# EAGLE design registers-edge (EAGLE 5.11)

## Sheet 1 of 3
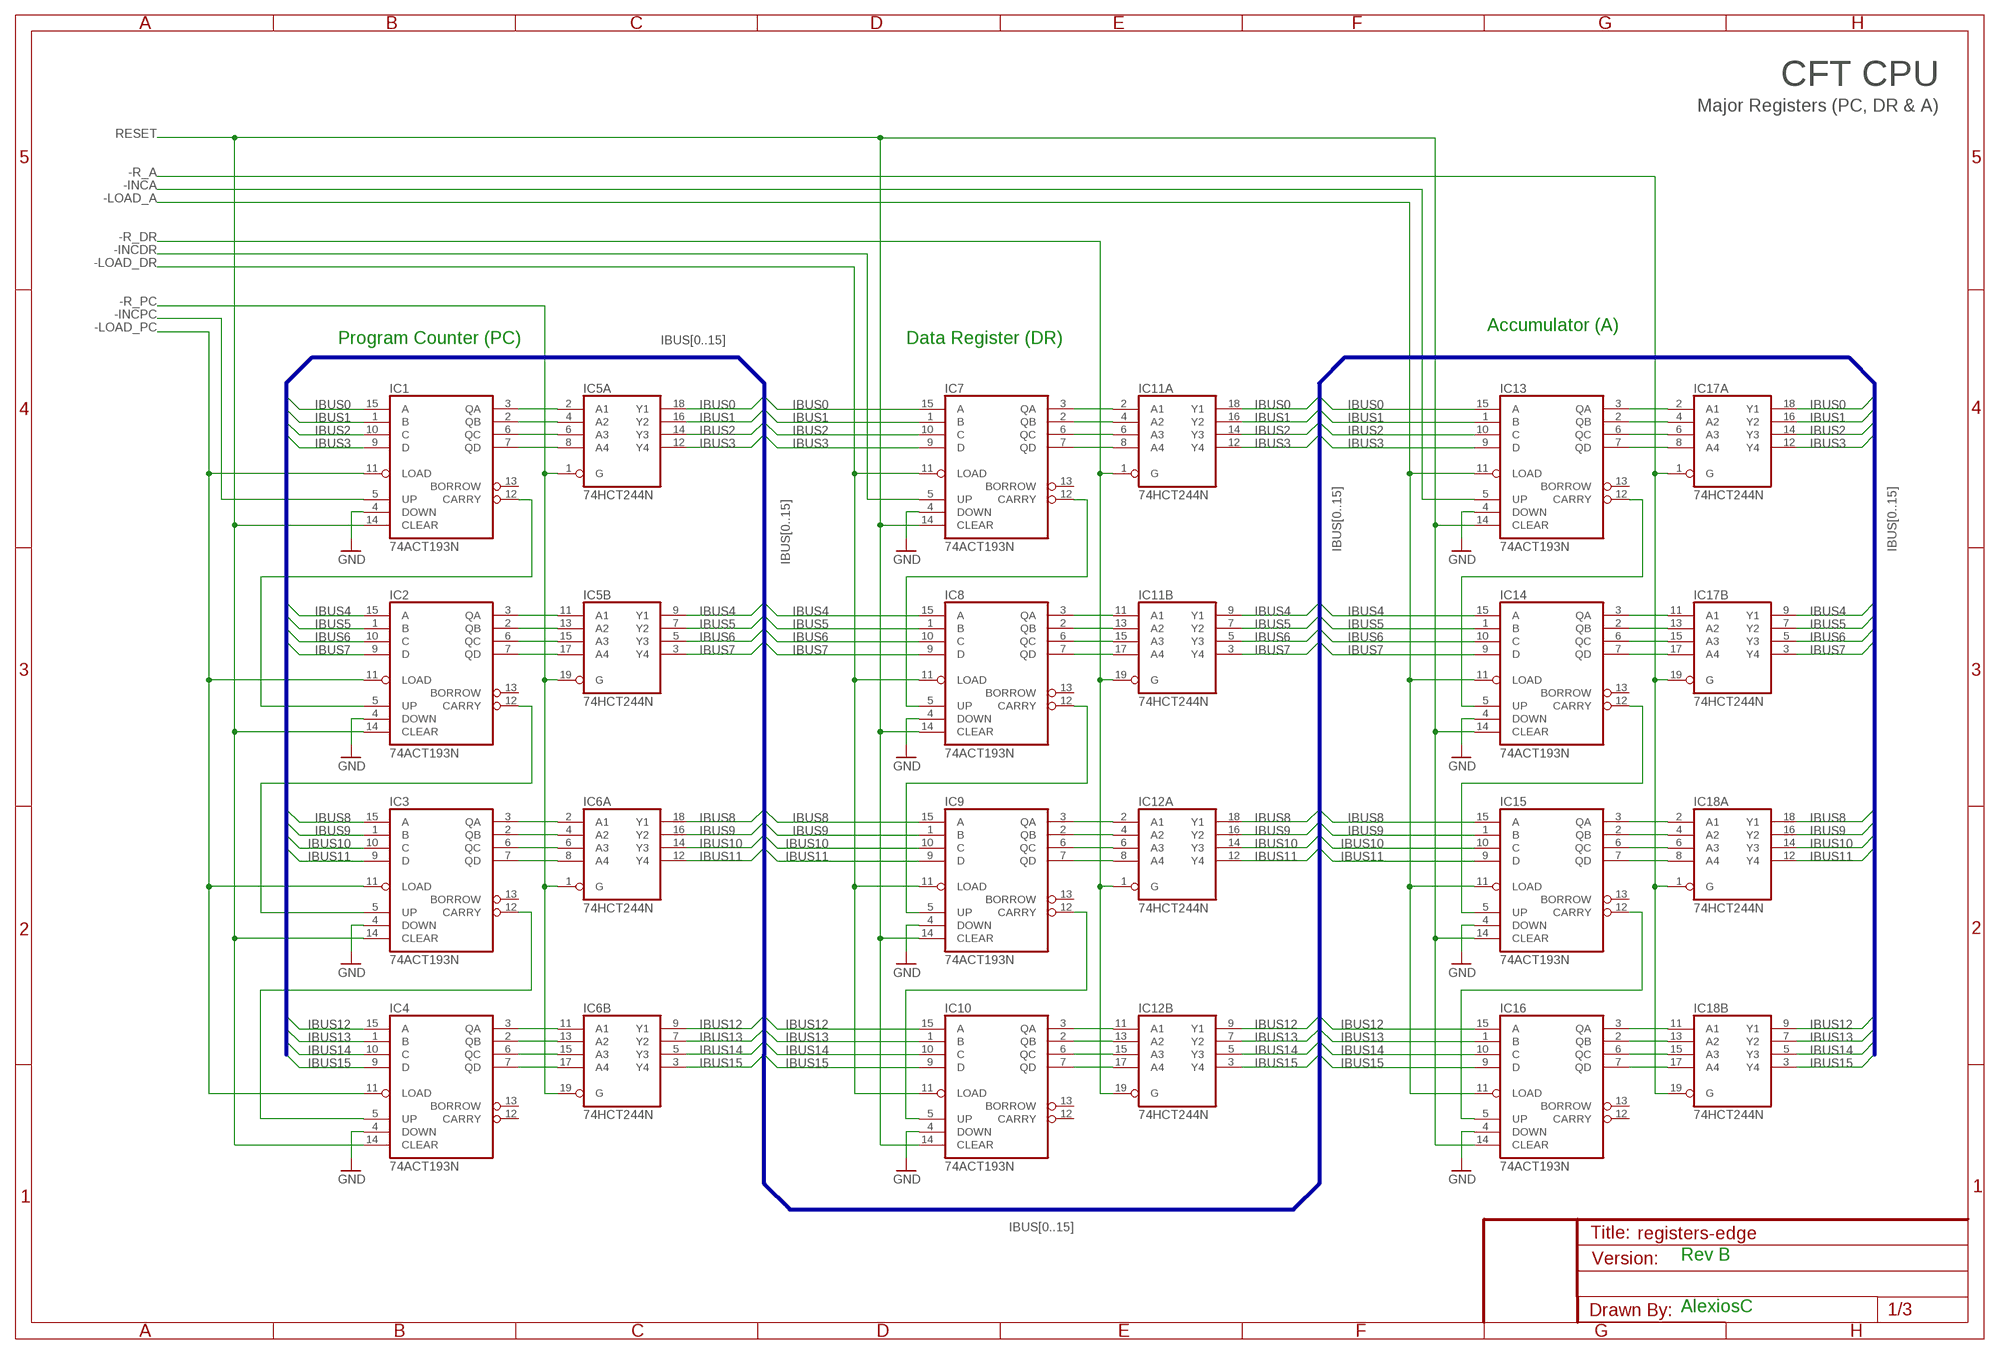
[diagram p0: schematic, sheet 1]

### Parts
IC1  74ACT193N  [DIL16]
IC2  74ACT193N  [DIL16]
IC3  74ACT193N  [DIL16]
IC4  74ACT193N  [DIL16]
IC5  74HCT244N  [DIL20]
IC6  74HCT244N  [DIL20]
IC7  74ACT193N  [DIL16]
IC8  74ACT193N  [DIL16]
IC9  74ACT193N  [DIL16]
IC10  74ACT193N  [DIL16]
IC11  74HCT244N  [DIL20]
IC12  74HCT244N  [DIL20]
IC13  74ACT193N  [DIL16]
IC14  74ACT193N  [DIL16]
IC15  74ACT193N  [DIL16]
IC16  74ACT193N  [DIL16]
IC17  74HCT244N  [DIL20]
IC18  74HCT244N  [DIL20]

### Nets
-INCA: IC13.5(UP) ; also sheet 3
-INCDR: IC7.5(UP) ; also sheet 3
-INCPC: IC1.5(UP) ; also sheet 3
-LOAD_A: IC13.11(LOAD) IC14.11(LOAD) IC15.11(LOAD) IC16.11(LOAD) ; also sheet 2
-LOAD_DR: IC7.11(LOAD) IC8.11(LOAD) IC9.11(LOAD) IC10.11(LOAD) ; also sheet 2
-LOAD_PC: IC1.11(LOAD) IC2.11(LOAD) IC3.11(LOAD) IC4.11(LOAD) ; also sheet 2
-R_A: IC17.1(A:G) IC17.19(B:G) IC18.1(A:G) IC18.19(B:G) ; also sheet 3
-R_DR: IC11.1(A:G) IC11.19(B:G) IC12.1(A:G) IC12.19(B:G) ; also sheet 3
-R_PC: IC5.1(A:G) IC5.19(B:G) IC6.1(A:G) IC6.19(B:G) ; also sheet 3
GND [Power]: IC1.4(DOWN) IC2.4(DOWN) IC3.4(DOWN) IC4.4(DOWN) IC7.4(DOWN) IC8.4(DOWN) IC9.4(DOWN) IC10.4(DOWN) IC13.4(DOWN) IC14.4(DOWN) IC15.4(DOWN) IC16.4(DOWN) ; also sheet 2,3
IBUS0: IC1.15(A) IC5.18(A:Y1) IC7.15(A) IC11.18(A:Y1) IC13.15(A) IC17.18(A:Y1) ; also sheet 3
IBUS1: IC1.1(B) IC5.16(A:Y2) IC7.1(B) IC11.16(A:Y2) IC13.1(B) IC17.16(A:Y2) ; also sheet 3
IBUS2: IC1.10(C) IC5.14(A:Y3) IC7.10(C) IC11.14(A:Y3) IC13.10(C) IC17.14(A:Y3) ; also sheet 3
IBUS3: IC1.9(D) IC5.12(A:Y4) IC7.9(D) IC11.12(A:Y4) IC13.9(D) IC17.12(A:Y4) ; also sheet 3
IBUS4: IC2.15(A) IC5.9(B:Y1) IC8.15(A) IC11.9(B:Y1) IC14.15(A) IC17.9(B:Y1) ; also sheet 3
IBUS5: IC2.1(B) IC5.7(B:Y2) IC8.1(B) IC11.7(B:Y2) IC14.1(B) IC17.7(B:Y2) ; also sheet 3
IBUS6: IC2.10(C) IC5.5(B:Y3) IC8.10(C) IC11.5(B:Y3) IC14.10(C) IC17.5(B:Y3) ; also sheet 3
IBUS7: IC2.9(D) IC5.3(B:Y4) IC8.9(D) IC11.3(B:Y4) IC14.9(D) IC17.3(B:Y4) ; also sheet 3
IBUS8: IC3.15(A) IC6.18(A:Y1) IC9.15(A) IC12.18(A:Y1) IC15.15(A) IC18.18(A:Y1) ; also sheet 3
IBUS9: IC3.1(B) IC6.16(A:Y2) IC9.1(B) IC12.16(A:Y2) IC15.1(B) IC18.16(A:Y2) ; also sheet 3
IBUS10: IC3.10(C) IC6.14(A:Y3) IC9.10(C) IC12.14(A:Y3) IC15.10(C) IC18.14(A:Y3) ; also sheet 3
IBUS11: IC3.9(D) IC6.12(A:Y4) IC9.9(D) IC12.12(A:Y4) IC15.9(D) IC18.12(A:Y4) ; also sheet 3
IBUS12: IC4.15(A) IC6.9(B:Y1) IC10.15(A) IC12.9(B:Y1) IC16.15(A) IC18.9(B:Y1) ; also sheet 3
IBUS13: IC4.1(B) IC6.7(B:Y2) IC10.1(B) IC12.7(B:Y2) IC16.1(B) IC18.7(B:Y2) ; also sheet 3
IBUS14: IC4.10(C) IC6.5(B:Y3) IC10.10(C) IC12.5(B:Y3) IC16.10(C) IC18.5(B:Y3) ; also sheet 3
IBUS15: IC4.9(D) IC6.3(B:Y4) IC10.9(D) IC12.3(B:Y4) IC16.9(D) IC18.3(B:Y4) ; also sheet 3
N$1: IC1.3(QA) IC5.2(A:A1)
N$3: IC1.2(QB) IC5.4(A:A2)
N$4: IC1.6(QC) IC5.6(A:A3)
N$5: IC1.7(QD) IC5.8(A:A4)
N$6: IC2.3(QA) IC5.11(B:A1)
N$7: IC2.2(QB) IC5.13(B:A2)
N$8: IC2.6(QC) IC5.15(B:A3)
N$9: IC2.7(QD) IC5.17(B:A4)
N$10: IC3.3(QA) IC6.2(A:A1)
N$11: IC3.2(QB) IC6.4(A:A2)
N$12: IC3.6(QC) IC6.6(A:A3)
N$13: IC3.7(QD) IC6.8(A:A4)
N$14: IC4.3(QA) IC6.11(B:A1)
N$15: IC4.2(QB) IC6.13(B:A2)
N$16: IC4.6(QC) IC6.15(B:A3)
N$24: IC4.7(QD) IC6.17(B:A4)
N$25: IC1.12(CARRY) IC2.5(UP)
N$26: IC13.12(CARRY) IC14.5(UP)
N$27: IC14.12(CARRY) IC15.5(UP)
N$28: IC7.12(CARRY) IC8.5(UP)
N$29: IC2.12(CARRY) IC3.5(UP)
N$30: IC8.12(CARRY) IC9.5(UP)
N$31: IC3.12(CARRY) IC4.5(UP)
N$39: IC9.12(CARRY) IC10.5(UP)
N$43: IC7.3(QA) IC11.2(A:A1)
N$44: IC7.2(QB) IC11.4(A:A2)
N$45: IC7.6(QC) IC11.6(A:A3)
N$46: IC7.7(QD) IC11.8(A:A4)
N$58: IC8.3(QA) IC11.11(B:A1)
N$66: IC8.2(QB) IC11.13(B:A2)
N$67: IC8.6(QC) IC11.15(B:A3)
N$68: IC8.7(QD) IC11.17(B:A4)
N$69: IC9.3(QA) IC12.2(A:A1)
N$70: IC9.2(QB) IC12.4(A:A2)
N$71: IC9.6(QC) IC12.6(A:A3)
N$72: IC9.7(QD) IC12.8(A:A4)
N$73: IC10.3(QA) IC12.11(B:A1)
N$74: IC10.2(QB) IC12.13(B:A2)
N$75: IC10.6(QC) IC12.15(B:A3)
N$76: IC10.7(QD) IC12.17(B:A4)
N$77: IC15.12(CARRY) IC16.5(UP)
N$78: IC13.3(QA) IC17.2(A:A1)
N$79: IC13.2(QB) IC17.4(A:A2)
N$80: IC13.6(QC) IC17.6(A:A3)
N$81: IC13.7(QD) IC17.8(A:A4)
N$82: IC14.3(QA) IC17.11(B:A1)
N$83: IC14.2(QB) IC17.13(B:A2)
N$84: IC14.6(QC) IC17.15(B:A3)
N$85: IC14.7(QD) IC17.17(B:A4)
N$86: IC15.3(QA) IC18.2(A:A1)
N$87: IC15.2(QB) IC18.4(A:A2)
N$88: IC15.6(QC) IC18.6(A:A3)
N$89: IC15.7(QD) IC18.8(A:A4)
N$90: IC16.3(QA) IC18.11(B:A1)
N$91: IC16.2(QB) IC18.13(B:A2)
N$92: IC16.6(QC) IC18.15(B:A3)
N$93: IC16.7(QD) IC18.17(B:A4)
RESET: IC1.14(CLEAR) IC2.14(CLEAR) IC3.14(CLEAR) IC4.14(CLEAR) IC7.14(CLEAR) IC8.14(CLEAR) IC9.14(CLEAR) IC10.14(CLEAR) IC13.14(CLEAR) IC14.14(CLEAR) IC15.14(CLEAR) IC16.14(CLEAR) ; also sheet 2
Unconnected: IC1.13(BORROW) IC2.13(BORROW) IC3.13(BORROW) IC4.12(CARRY) IC4.13(BORROW) IC7.13(BORROW) IC8.13(BORROW) IC9.13(BORROW) IC10.12(CARRY) IC10.13(BORROW) IC13.13(BORROW) IC14.13(BORROW) IC15.13(BORROW) IC16.12(CARRY) IC16.13(BORROW)

### Buses
IBUS[0..15]

### Notes on the sheet
- CFT CPU
- Major Registers (PC, DR & A)
- Accumulator (A)
- Program Counter (PC) | Data Register (DR)
- Rev B
- AlexiosC

## Sheet 2 of 3
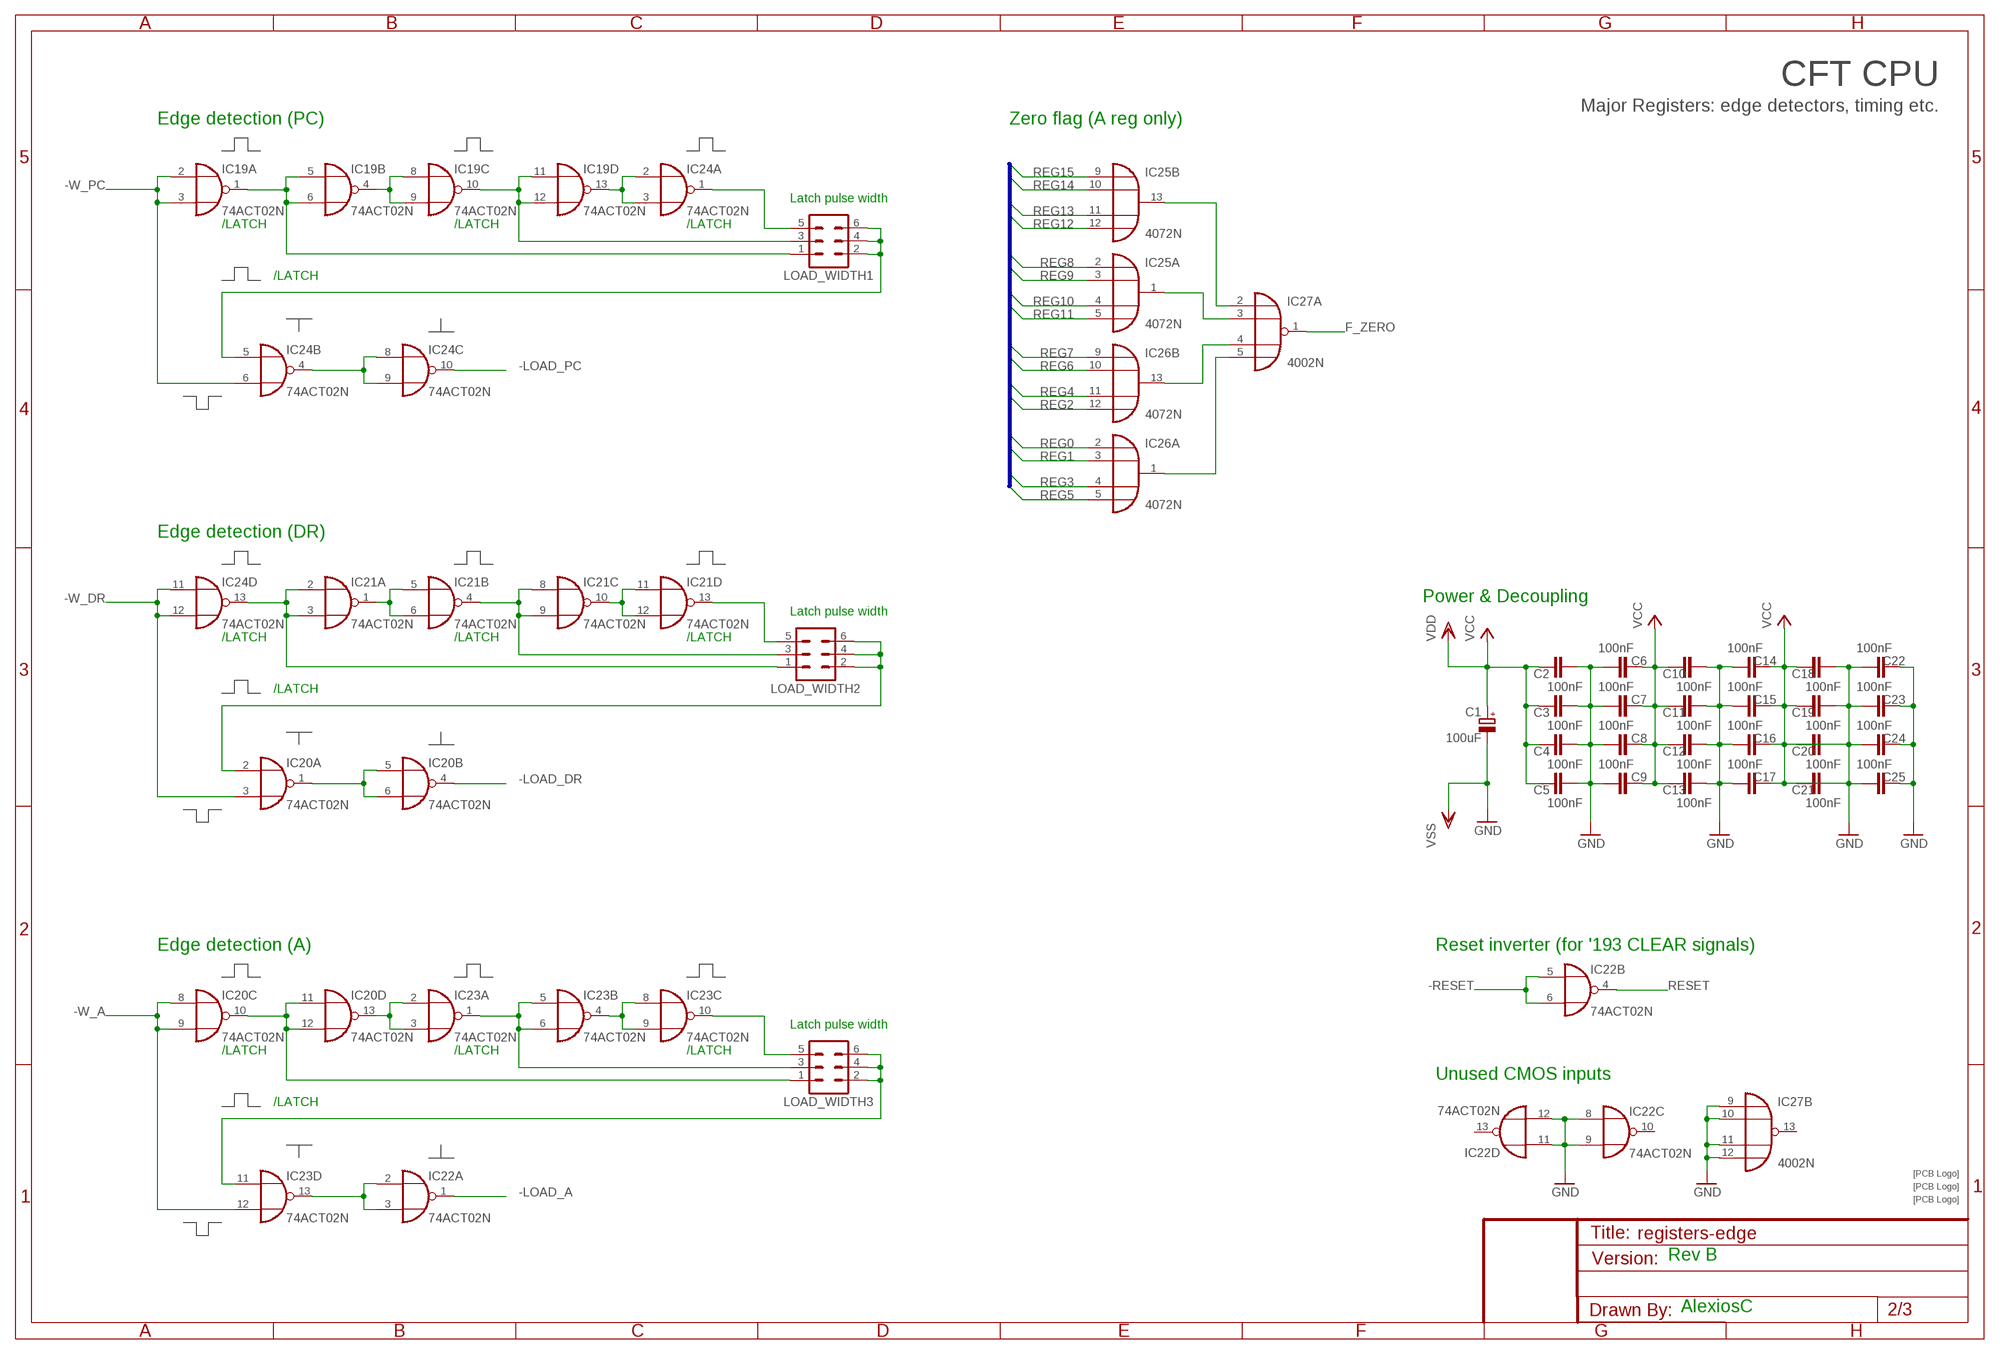
[diagram p1: schematic, sheet 2]

### Parts
C1  100uF  CPOL-EUE2.5-6  [E2,5-6]
C2  100nF  C-EU025-025X050  [C025-025X050]
C3  100nF  C-EU025-025X050  [C025-025X050]
C4  100nF  C-EU025-025X050  [C025-025X050]
C5  100nF  C-EU025-025X050  [C025-025X050]
C6  100nF  C-EU025-025X050  [C025-025X050]
C7  100nF  C-EU025-025X050  [C025-025X050]
C8  100nF  C-EU025-025X050  [C025-025X050]
C9  100nF  C-EU025-025X050  [C025-025X050]
C10  100nF  C-EU025-025X050  [C025-025X050]
C11  100nF  C-EU025-025X050  [C025-025X050]
C12  100nF  C-EU025-025X050  [C025-025X050]
C13  100nF  C-EU025-025X050  [C025-025X050]
C14  100nF  C-EU025-025X050  [C025-025X050]
C15  100nF  C-EU025-025X050  [C025-025X050]
C16  100nF  C-EU025-025X050  [C025-025X050]
C17  100nF  C-EU025-025X050  [C025-025X050]
C18  100nF  C-EU025-025X050  [C025-025X050]
C19  100nF  C-EU025-025X050  [C025-025X050]
C20  100nF  C-EU025-025X050  [C025-025X050]
C21  100nF  C-EU025-025X050  [C025-025X050]
C22  100nF  C-EU025-025X050  [C025-025X050]
C23  100nF  C-EU025-025X050  [C025-025X050]
C24  100nF  C-EU025-025X050  [C025-025X050]
C25  100nF  C-EU025-025X050  [C025-025X050]
IC19  74ACT02N  [DIL14]
IC20  74ACT02N  [DIL14]
IC21  74ACT02N  [DIL14]
IC22  74ACT02N  [DIL14]
IC23  74ACT02N  [DIL14]
IC24  74ACT02N  [DIL14]
IC25  4072N  [DIL14]
IC26  4072N  [DIL14]
IC27  4002N  [DIL14]
LOAD_WIDTH1  MA03-2  [MA03-2]
LOAD_WIDTH2  MA03-2  [MA03-2]
LOAD_WIDTH3  MA03-2  [MA03-2]
U$4  SIGNATUREPLANE  [SIGNATURE_PLANE]
U$5  SIGNATUREPLANE  [SIGNATURE_PLANE]
U$6  SIGNATURESILK  [SIGNATURE]

### Nets
-LOAD_A: IC22.1(A:O) ; also sheet 1
-LOAD_DR: IC20.4(B:O) ; also sheet 1
-LOAD_PC: IC24.10(C:O) ; also sheet 1
-RESET: IC22.5(B:I0) IC22.6(B:I1) ; also sheet 3
-W_A: IC20.8(C:I0) IC20.9(C:I1) IC23.12(D:I1) ; also sheet 3
-W_DR: IC20.3(A:I1) IC24.11(D:I0) IC24.12(D:I1) ; also sheet 3
-W_PC: IC19.2(A:I0) IC19.3(A:I1) IC24.6(B:I1) ; also sheet 3
F_ZERO: IC27.1(A:O) ; also sheet 3
GND [Power]: C1.- C2.1 C3.1 C4.1 C5.1 C6.1 C7.1 C8.1 C9.1 C10.1 C11.1 C12.1 C13.1 C14.1 C15.1 C16.1 C17.1 C18.1 C19.1 C20.2 C21.2 C22.1 C22.2 C23.1 C23.2 C24.1 C24.2 C25.1 C25.2 IC22.8(C:I0) IC22.9(C:I1) IC22.11(D:I0) IC22.12(D:I1) IC27.9(B:I0) IC27.10(B:I1) IC27.11(B:I2) IC27.12(B:I3) ; supply symbol labelled VSS ; also sheet 1,3
N$17: IC25.13(B:O) IC27.2(A:I0)
N$18: IC25.1(A:O) IC27.3(A:I1)
N$19: IC26.13(B:O) IC27.4(A:I2)
N$20: IC26.1(A:O) IC27.5(A:I3)
N$32: IC19.1(A:O) IC19.5(B:I0) IC19.6(B:I1) LOAD_WIDTH1.1
N$33: IC19.4(B:O) IC19.8(C:I0) IC19.9(C:I1)
N$34: IC19.10(C:O) IC19.11(D:I0) IC19.12(D:I1) LOAD_WIDTH1.3
N$35: IC19.13(D:O) IC24.2(A:I0) IC24.3(A:I1)
N$36: IC24.1(A:O) LOAD_WIDTH1.5
N$37: IC24.5(B:I0) LOAD_WIDTH1.2 LOAD_WIDTH1.4 LOAD_WIDTH1.6
N$38: IC24.4(B:O) IC24.8(C:I0) IC24.9(C:I1)
N$40: IC21.2(A:I0) IC21.3(A:I1) IC24.13(D:O) LOAD_WIDTH2.1
N$41: IC21.1(A:O) IC21.5(B:I0) IC21.6(B:I1)
N$42: IC21.4(B:O) IC21.8(C:I0) IC21.9(C:I1) LOAD_WIDTH2.3
N$94: IC21.10(C:O) IC21.11(D:I0) IC21.12(D:I1)
N$95: IC21.13(D:O) LOAD_WIDTH2.5
N$96: IC20.2(A:I0) LOAD_WIDTH2.2 LOAD_WIDTH2.4 LOAD_WIDTH2.6
N$97: IC20.1(A:O) IC20.5(B:I0) IC20.6(B:I1)
N$98: IC20.10(C:O) IC20.11(D:I0) IC20.12(D:I1) LOAD_WIDTH3.1
N$99: IC20.13(D:O) IC23.2(A:I0) IC23.3(A:I1)
N$100: IC23.1(A:O) IC23.5(B:I0) IC23.6(B:I1) LOAD_WIDTH3.3
N$101: IC23.4(B:O) IC23.8(C:I0) IC23.9(C:I1)
N$102: IC23.10(C:O) LOAD_WIDTH3.5
N$103: IC23.11(D:I0) LOAD_WIDTH3.2 LOAD_WIDTH3.4 LOAD_WIDTH3.6
N$104: IC22.2(A:I0) IC22.3(A:I1) IC23.13(D:O)
REG0: IC26.2(A:I0)
REG1: IC26.3(A:I1)
REG2: IC26.12(B:I3)
REG3: IC26.4(A:I2)
REG4: IC26.11(B:I2)
REG5: IC26.5(A:I3)
REG6: IC26.10(B:I1)
REG7: IC26.9(B:I0)
REG8: IC25.2(A:I0)
REG9: IC25.3(A:I1)
REG10: IC25.4(A:I2)
REG11: IC25.5(A:I3)
REG12: IC25.12(B:I3)
REG13: IC25.11(B:I2)
REG14: IC25.10(B:I1)
REG15: IC25.9(B:I0)
RESET: IC22.4(B:O) ; also sheet 1
VCC [Power]: C1.+ C2.2 C3.2 C4.2 C5.2 C6.2 C7.2 C8.2 C9.2 C10.2 C11.2 C12.2 C13.2 C14.2 C15.2 C16.2 C17.2 C18.2 C19.2 C20.1 C21.1 ; supply symbol labelled VDD ; also sheet 3
Unconnected: IC22.10(C:O) IC22.13(D:O) IC27.13(B:O)

### Buses
REG[0..15]

### Notes on the sheet
- CFT CPU
- Major Registers: edge detectors, timing etc.
- Edge detection (PC) | Zero flag (A reg only)
- Latch pulse width
- /LATCH | /LATCH | /LATCH
- /LATCH
- Edge detection (DR)
- Power & Decoupling
- Latch pulse width
- /LATCH | /LATCH | /LATCH
- /LATCH
- Edge detection (A) | Reset inverter (for '193 CLEAR signals)
- Latch pulse width
- /LATCH | /LATCH | /LATCH
- Unused CMOS inputs
- /LATCH
- Rev B
- AlexiosC

## Sheet 3 of 3
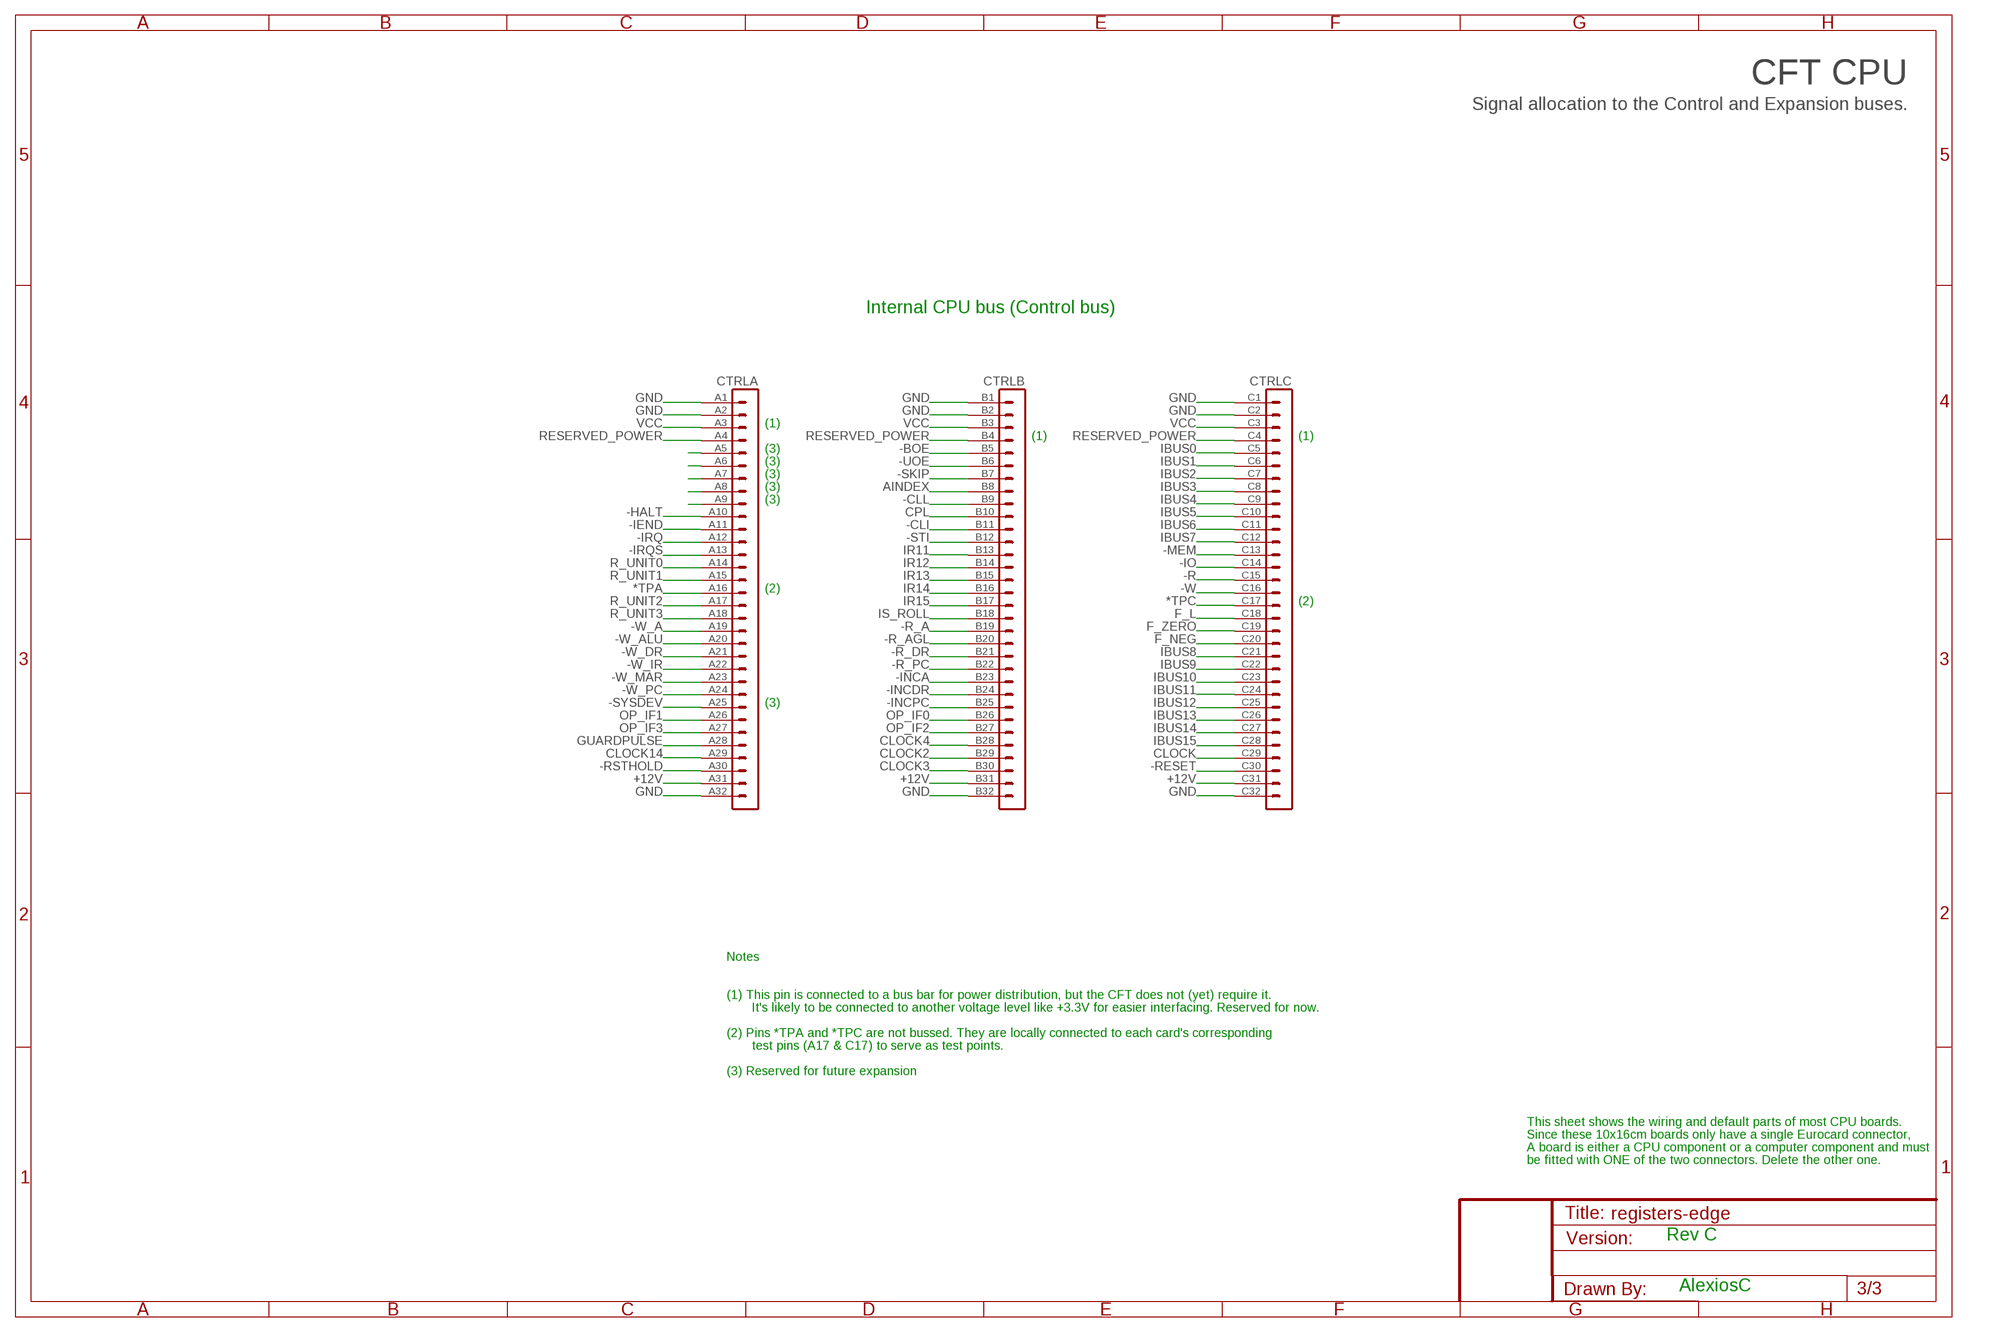
[diagram p2: schematic, sheet 3]

### Parts
CTRL  VG96-3B  [VG96B]

### Nets
*TPA: CTRL.A16
*TPC: CTRL.C17
+12V [12V]: CTRL.A31 CTRL.B31 CTRL.C31
-BOE: CTRL.B5
-CLI: CTRL.B11
-CLL: CTRL.B9
-HALT: CTRL.A10
-IEND: CTRL.A11
-INCA: CTRL.B23 ; also sheet 1
-INCDR: CTRL.B24 ; also sheet 1
-INCPC: CTRL.B25 ; also sheet 1
-IO: CTRL.C14
-IRQ: CTRL.A12
-IRQS: CTRL.A13
-MEM: CTRL.C13
-R: CTRL.C15
-R_A: CTRL.B19 ; also sheet 1
-R_AGL: CTRL.B20
-R_DR: CTRL.B21 ; also sheet 1
-R_PC: CTRL.B22 ; also sheet 1
-RESET: CTRL.C30 ; also sheet 2
-RSTHOLD: CTRL.A30
-SKIP: CTRL.B7
-STI: CTRL.B12
-SYSDEV: CTRL.A25
-UOE: CTRL.B6
-W: CTRL.C16
-W_A: CTRL.A19 ; also sheet 2
-W_ALU: CTRL.A20
-W_DR: CTRL.A21 ; also sheet 2
-W_IR: CTRL.A22
-W_MAR: CTRL.A23
-W_PC: CTRL.A24 ; also sheet 2
AINDEX: CTRL.B8
CLOCK: CTRL.C29
CLOCK2: CTRL.B29
CLOCK3: CTRL.B30
CLOCK4: CTRL.B28
CLOCK14: CTRL.A29
CPL: CTRL.B10
F_L: CTRL.C18
F_NEG: CTRL.C20
F_ZERO: CTRL.C19 ; also sheet 2
GND [Power]: CTRL.A1 CTRL.A2 CTRL.A32 CTRL.B1 CTRL.B2 CTRL.B32 CTRL.C1 CTRL.C2 CTRL.C32 ; also sheet 1,2
GUARDPULSE: CTRL.A28
IBUS0: CTRL.C5 ; also sheet 1
IBUS1: CTRL.C6 ; also sheet 1
IBUS2: CTRL.C7 ; also sheet 1
IBUS3: CTRL.C8 ; also sheet 1
IBUS4: CTRL.C9 ; also sheet 1
IBUS5: CTRL.C10 ; also sheet 1
IBUS6: CTRL.C11 ; also sheet 1
IBUS7: CTRL.C12 ; also sheet 1
IBUS8: CTRL.C21 ; also sheet 1
IBUS9: CTRL.C22 ; also sheet 1
IBUS10: CTRL.C23 ; also sheet 1
IBUS11: CTRL.C24 ; also sheet 1
IBUS12: CTRL.C25 ; also sheet 1
IBUS13: CTRL.C26 ; also sheet 1
IBUS14: CTRL.C27 ; also sheet 1
IBUS15: CTRL.C28 ; also sheet 1
IR11: CTRL.B13
IR12: CTRL.B14
IR13: CTRL.B15
IR14: CTRL.B16
IR15: CTRL.B17
IS_ROLL: CTRL.B18
N$2: CTRL.A5
N$48: CTRL.A9
N$49: CTRL.A8
N$50: CTRL.A7
N$51: CTRL.A6
OP_IF0: CTRL.B26
OP_IF1: CTRL.A26
OP_IF2: CTRL.B27
OP_IF3: CTRL.A27
R_UNIT0: CTRL.A14
R_UNIT1: CTRL.A15
R_UNIT2: CTRL.A17
R_UNIT3: CTRL.A18
RESERVED_POWER: CTRL.A4 CTRL.B4 CTRL.C4
VCC [Power]: CTRL.A3 CTRL.B3 CTRL.C3 ; also sheet 2

### Notes on the sheet
- CFT CPU
- Signal allocation to the Control and Expansion buses.
- Internal CPU bus (Control bus)
- (1)
- (1) | (1)
- (3)
- (3)
- (3)
- (3)
- (3)
- (2)
- (2)
- (3)
- Notes
- (1) This pin is connected to a bus bar for power distribution, but the CFT does not (yet) require it.
- It's likely to be connected to another voltage level like +3.3V for easier interfacing. Reserved for now.
- (2) Pins *TPA and *TPC are not bussed. They are locally connected to each card's corresponding
- test pins (A17 & C17) to serve as test points.
- (3) Reserved for future expansion
- This sheet shows the wiring and default parts of most CPU boards.
- Since these 10x16cm boards only have a single Eurocard connector,
- A board is either a CPU component or a computer component and must
- be fitted with ONE of the two connectors. Delete the other one.
- Rev C
- AlexiosC

## Power pins joined to a net without a drawn wire
GND: IC1.8(GND) IC2.8(GND) IC3.8(GND) IC4.8(GND) IC5.10(P:GND) IC6.10(P:GND) IC7.8(GND) IC8.8(GND) IC9.8(GND) IC10.8(GND) IC11.10(P:GND) IC12.10(P:GND) IC13.8(GND) IC14.8(GND) IC15.8(GND) IC16.8(GND) IC17.10(P:GND) IC18.10(P:GND) IC19.7(P:GND) IC20.7(P:GND) IC21.7(P:GND) IC22.7(P:GND) IC23.7(P:GND) IC24.7(P:GND) IC25.7(P:VSS) IC26.7(P:VSS) IC27.7(P:VSS)
VCC: IC1.16(VCC) IC2.16(VCC) IC3.16(VCC) IC4.16(VCC) IC5.20(P:VCC) IC6.20(P:VCC) IC7.16(VCC) IC8.16(VCC) IC9.16(VCC) IC10.16(VCC) IC11.20(P:VCC) IC12.20(P:VCC) IC13.16(VCC) IC14.16(VCC) IC15.16(VCC) IC16.16(VCC) IC17.20(P:VCC) IC18.20(P:VCC) IC19.14(P:VCC) IC20.14(P:VCC) IC21.14(P:VCC) IC22.14(P:VCC) IC23.14(P:VCC) IC24.14(P:VCC) IC25.14(P:VDD) IC26.14(P:VDD) IC27.14(P:VDD)

## Library data of the parts
C1 = rcl:CPOL-EU: POLARIZED CAPACITOR, European symbol
C2-C25 = rcl:C-EU: CAPACITOR, European symbol
CTRL = 19inch:VG96-3: PCB EUROCARD, 96-pin type C/ABC, 2.54 mm
IC1-IC4 IC7-IC10 IC13-IC16 = alexios:74*193: Presettable Synchronous Binary Up/Down Counter Up/down 4-bit binary counter with load and clear inputs, and borrow and carry outputs. Farnell description: <http://uk.farnell.com/nxp/74hct193n/ic-74hct-cmos-74hct193-dip16-5v/dp/382218> Order Code: 382218 Manufacturer Part No: 74HCT193N RoHS : Yes Description: IC, 74HCT CMOS, 74HCT193, DIP16, 5V Counter Type:Binary Clock Frequency:47MHz Count Maximum:15 Supply Voltage Range:4.5V to 5.5V Logic Case Style:DIP No. of Pins:16 Operating Temperature Range:-40°C to +125°C Base Number:74 Clock Frequency Max:43MHz Count Max:16 Counter Measuring Functions:Presettable Synchronous Binary Up / Down Counter Device Marking:74HCT193 IC Generic Number:74HCT193 Logic Function Number:193 Logic IC Base Number:74193 Logic IC Family:HCT Logic IC Function:Presettable Synchronous 4bit Binary Up/Down Counter No. of Gates:1 No. of Inputs:4 Operating Temperature Max:125°C Operating Temperature Min:-40°C Package / Case:DIP Supply Voltage:5V Supply Voltage Max:5.5V Supply Voltage Min:4.5V Termination Type:Through Hole
IC5 IC6 IC11 IC12 IC17 IC18 = 74xx-eu:74*244: Octal BUFFER and LINE DRIVER, 3-state
IC19-IC24 = 74xx-eu:74*02: Quad 2-input NOR gate
IC25 IC26 = 40xx:4072: Dual 4-input OR
IC27 = 40xx:4002: 4-input NOR
LOAD_WIDTH1-LOAD_WIDTH3 = con-lstb:MA03-2: PIN HEADER; OC_FARNELL: unknown; OC_NEWARK: unknown
U$4-U$6 = alexios:SIGNATURE: Soup signature

## Net classes
1 Power: width 0.914 mm, clearance 0.61 mm
2 12V: width 1.016 mm, clearance 1.016 mm

## Board
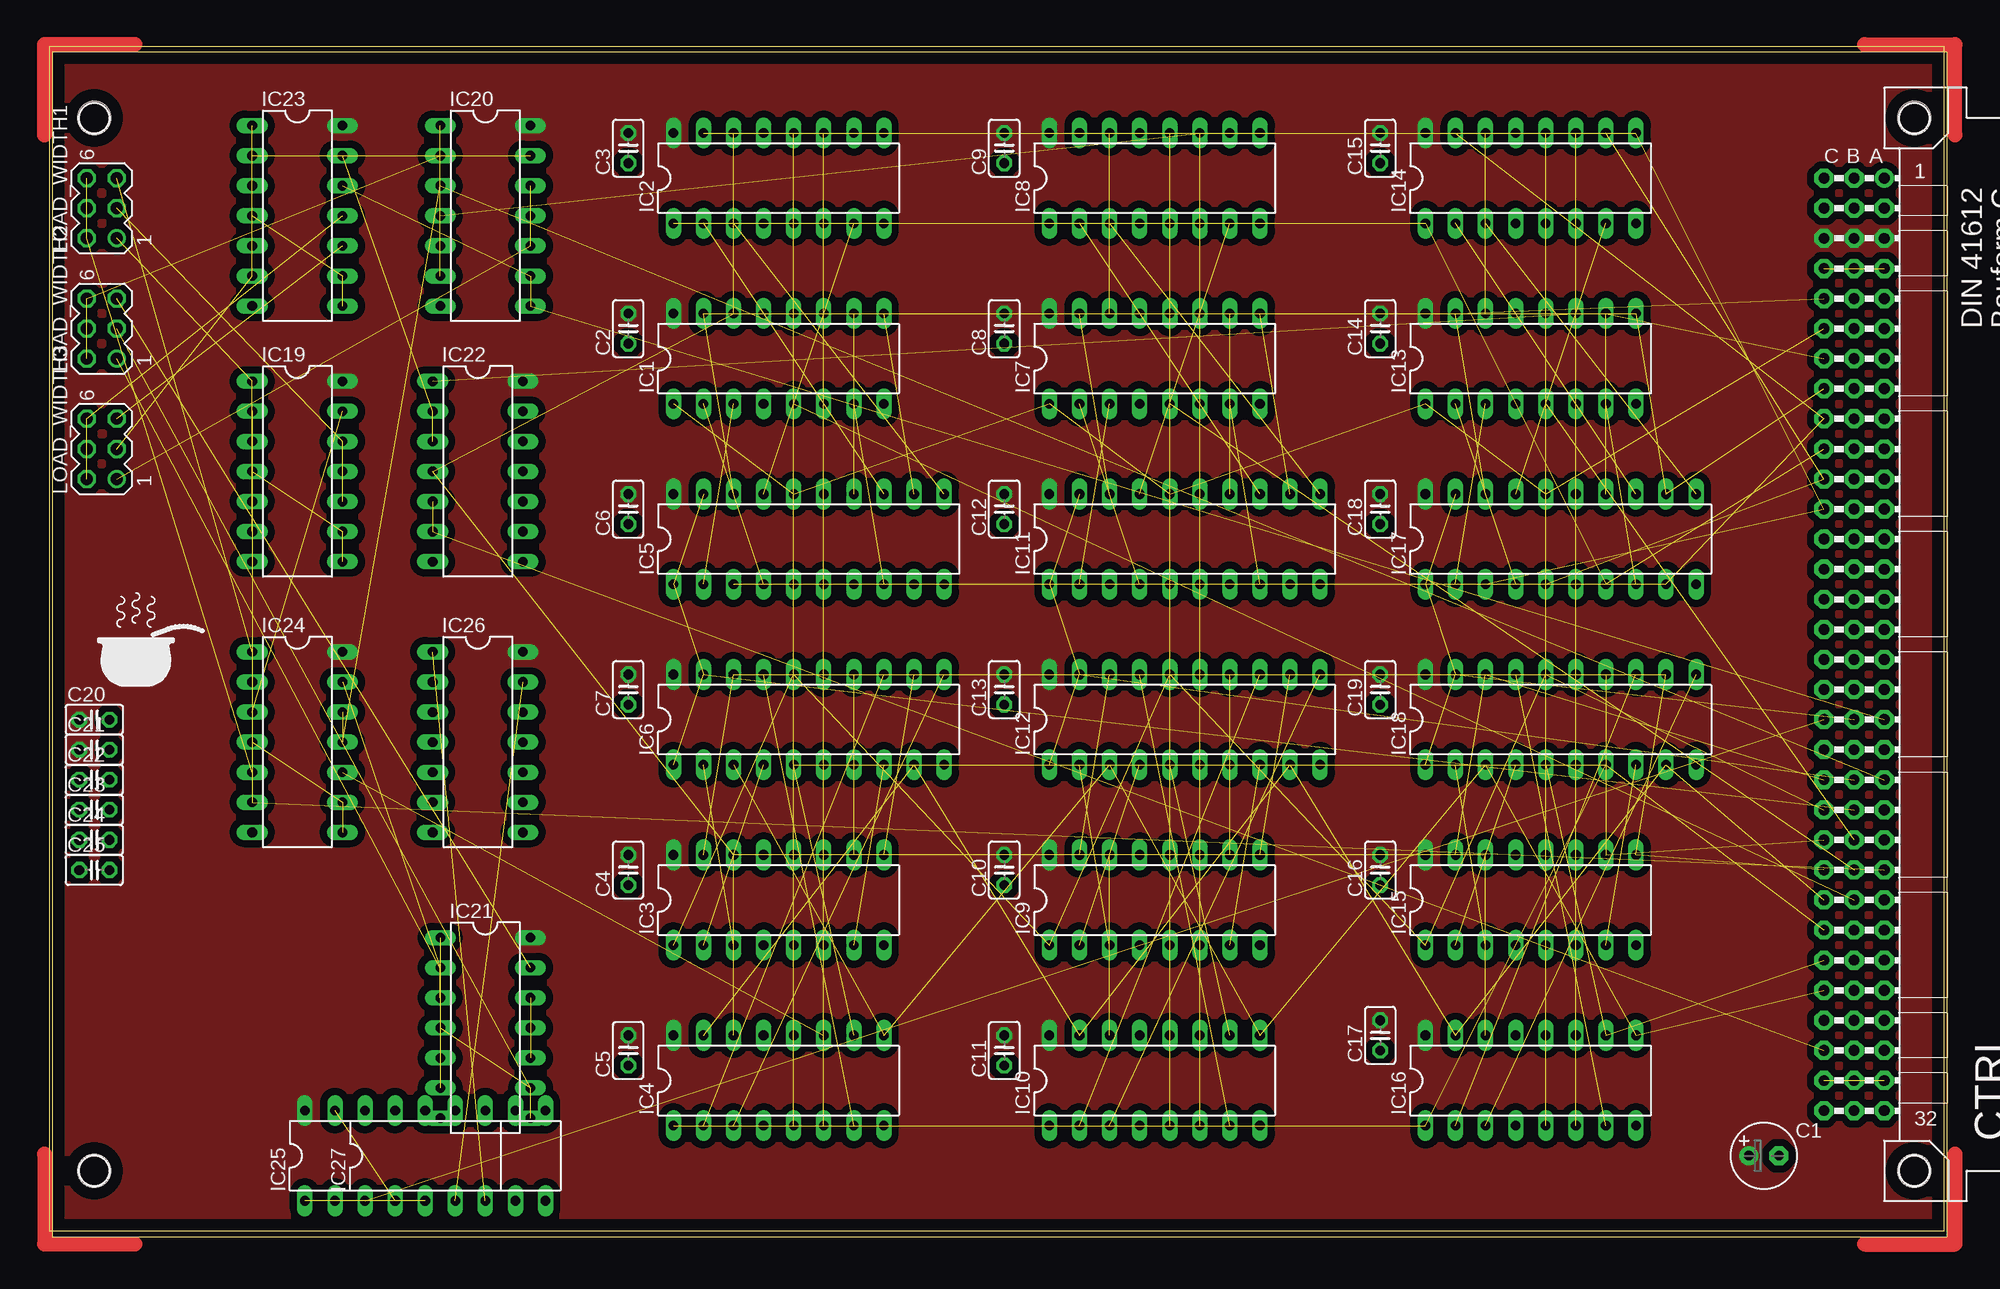
[diagram p3: board, top side]
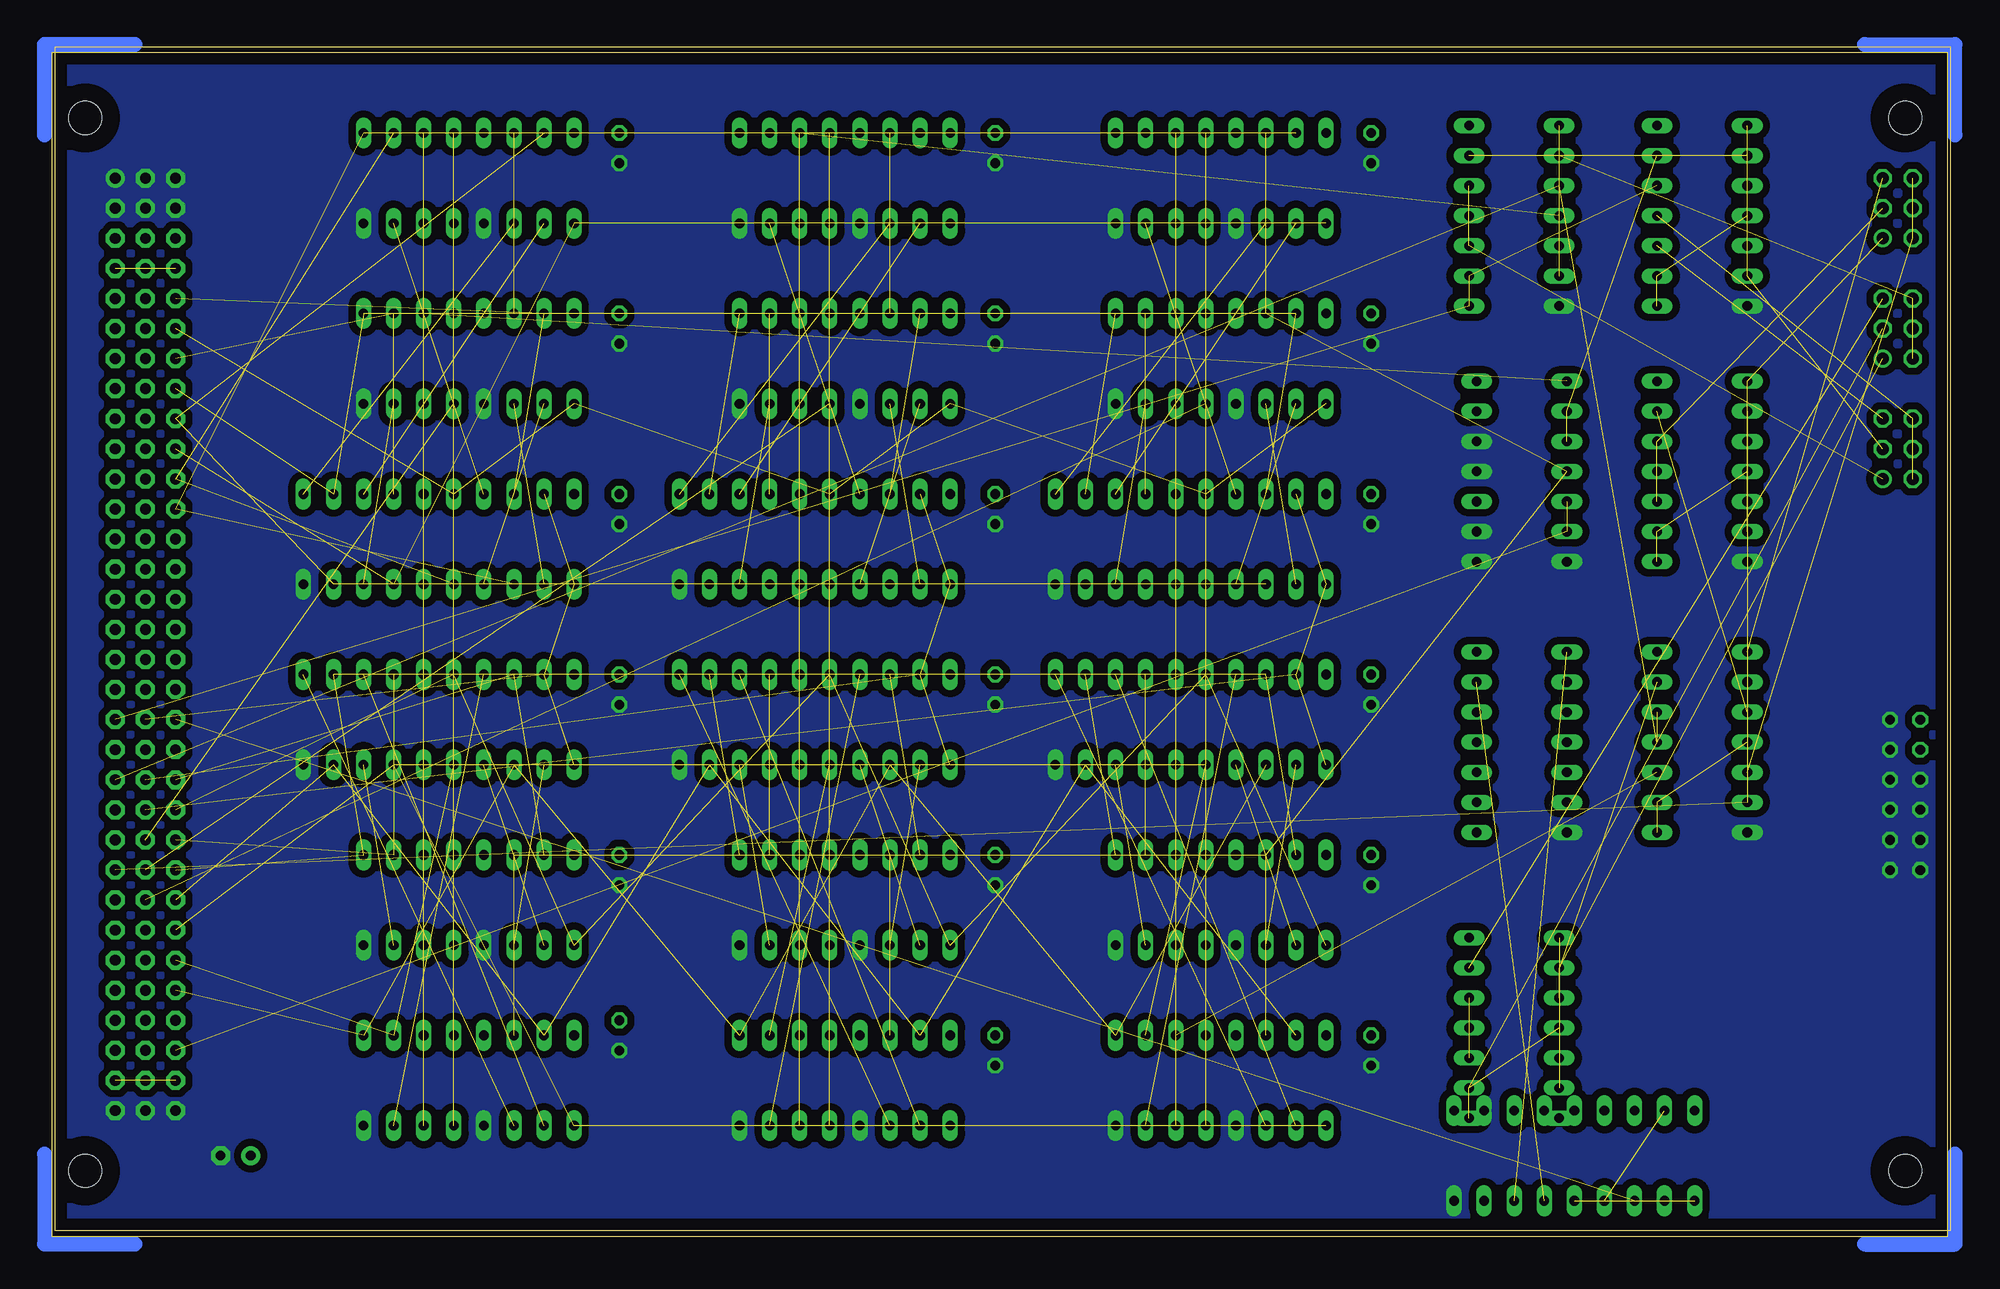
[diagram p4: board, bottom side, seen from below]

Size 160 x 100 mm. Coordinates in mm from the lower left corner, seen from the top.
Outline: 0,0 160,0 160,100 0,100 0,0
Copper layers (1*16): Top 0.035mm / dielectric 1.5mm / Bottom 0.035mm
Design rules "default": minimum track width 10mil, minimum drill 24mil, track to track 8mil, track to pad 8mil, pad to pad 8mil, via to via 8mil, smd to smd 8mil, copper to edge 40mil, drill to drill 8mil, minimum pad ring 10mil, minimum via ring 8mil, stop-mask expansion 4mil, vias tented up to drill 0mil, thermal gap 10mil

### Footprints (pad centres in the part's own frame; a part is rotated, then mirrored left to right if it is on the bottom)
E2,5-6 = drill 0.813 pad 1.6 round: + -1.27,0 | drill 0.813 pad 1.6 octagon: - 1.27,0
C025-025X050 = drill 0.813 octagon: 1 -1.27,0; 2 1.27,0
VG96B = drill 0.914 pad 1.6 round: A1 154.94,39.37 | drill 0.914 pad 1.6 octagon: A2 154.94,36.83; A3 154.94,34.29; A4 154.94,31.75; A5 154.94,29.21; A6 154.94,26.67; A7 154.94,24.13; A8 154.94,21.59; A9 154.94,19.05; A10 154.94,16.51; A11 154.94,13.97; A12 154.94,11.43; A13 154.94,8.89; A14 154.94,6.35; A15 154.94,3.81; A16 154.94,1.27; A17 154.94,-1.27; A18 154.94,-3.81; A19 154.94,-6.35; A20 154.94,-8.89; A21 154.94,-11.43; A22 154.94,-13.97; A23 154.94,-16.51; A24 154.94,-19.05; A25 154.94,-21.59; A26 154.94,-24.13; A27 154.94,-26.67; A28 154.94,-29.21; A29 154.94,-31.75; A30 154.94,-34.29; A31 154.94,-36.83; A32 154.94,-39.37; B1 152.4,39.37; B2 152.4,36.83; B3 152.4,34.29; B4 152.4,31.75; B5 152.4,29.21; B6 152.4,26.67; B7 152.4,24.13; B8 152.4,21.59; B9 152.4,19.05; B10 152.4,16.51; B11 152.4,13.97; B12 152.4,11.43; B13 152.4,8.89; B14 152.4,6.35; B15 152.4,3.81; B16 152.4,1.27; B17 152.4,-1.27; B18 152.4,-3.81; B19 152.4,-6.35; B20 152.4,-8.89; B21 152.4,-11.43; B22 152.4,-13.97; B23 152.4,-16.51; B24 152.4,-19.05; B25 152.4,-21.59; B26 152.4,-24.13; B27 152.4,-26.67; B28 152.4,-29.21; B29 152.4,-31.75; B30 152.4,-34.29; B31 152.4,-36.83; B32 152.4,-39.37; C1 149.86,39.37; C2 149.86,36.83; C3 149.86,34.29; C4 149.86,31.75; C5 149.86,29.21; C6 149.86,26.67; C7 149.86,24.13; C8 149.86,21.59; C9 149.86,19.05; C10 149.86,16.51; C11 149.86,13.97; C12 149.86,11.43; C13 149.86,8.89; C14 149.86,6.35; C15 149.86,3.81; C16 149.86,1.27; C17 149.86,-1.27; C18 149.86,-3.81; C19 149.86,-6.35; C20 149.86,-8.89; C21 149.86,-11.43; C22 149.86,-13.97; C23 149.86,-16.51; C24 149.86,-19.05; C25 149.86,-21.59; C26 149.86,-24.13; C27 149.86,-26.67; C28 149.86,-29.21; C29 149.86,-31.75; C30 149.86,-34.29; C31 149.86,-36.83; C32 149.86,-39.37 | hole 2.794: 157.48,44.45; 157.48,-44.45; 3.81,44.45; 3.81,-44.45
DIL16 = drill 0.813 long: 1 -8.89,-3.81; 2 -6.35,-3.81; 3 -3.81,-3.81; 4 -1.27,-3.81; 5 1.27,-3.81; 6 3.81,-3.81; 7 6.35,-3.81; 8 8.89,-3.81; 9 8.89,3.81; 10 6.35,3.81; 11 3.81,3.81; 12 1.27,3.81; 13 -1.27,3.81; 14 -3.81,3.81; 15 -6.35,3.81; 16 -8.89,3.81
DIL20 = drill 0.813 long: 1 -11.43,-3.81; 2 -8.89,-3.81; 3 -6.35,-3.81; 4 -3.81,-3.81; 5 -1.27,-3.81; 6 1.27,-3.81; 7 3.81,-3.81; 8 6.35,-3.81; 9 8.89,-3.81; 10 11.43,-3.81; 11 11.43,3.81; 12 8.89,3.81; 13 6.35,3.81; 14 3.81,3.81; 15 1.27,3.81; 16 -1.27,3.81; 17 -3.81,3.81; 18 -6.35,3.81; 19 -8.89,3.81; 20 -11.43,3.81
DIL14 = drill 0.813 long: 1 -7.62,-3.81; 2 -5.08,-3.81; 3 -2.54,-3.81; 4 0,-3.81; 5 2.54,-3.81; 6 5.08,-3.81; 7 7.62,-3.81; 8 7.62,3.81; 9 5.08,3.81; 10 2.54,3.81; 11 0,3.81; 12 -2.54,3.81; 13 -5.08,3.81; 14 -7.62,3.81
MA03-2 = drill 1.016 round: 1 -2.54,-1.27 | drill 1.016 octagon: 2 -2.54,1.27; 3 0,-1.27; 4 0,1.27; 5 2.54,-1.27; 6 2.54,1.27

### Placement (x,y rotation side)
C1  144.78,6.35 0 top
C2  48.9,76.2 90 top
C3  48.9,91.44 90 top
C4  48.9,30.48 90 top
C5  48.9,15.24 90 top
C6  48.9,60.96 90 top
C7  48.9,45.72 90 top
C8  80.64,76.2 90 top
C9  80.64,91.44 90 top
C10  80.64,30.48 90 top
C11  80.64,15.24 90 top
C12  80.64,60.96 90 top
C13  80.64,45.72 90 top
C14  112.39,76.2 90 top
C15  112.39,91.44 90 top
C16  112.39,30.48 90 top
C17  112.39,16.51 90 top
C18  112.39,60.96 90 top
C19  112.39,45.72 90 top
C20  3.81,43.18 0 top
C21  3.81,40.64 0 top
C22  3.81,38.1 0 top
C23  3.81,35.56 0 top
C24  3.81,33.02 0 top
C25  3.81,30.48 0 top
CTRL  0,49.53 0 top
IC1  61.59,73.66 0 top
IC2  61.59,88.9 0 top
IC3  61.59,27.94 0 top
IC4  61.59,12.7 0 top
IC5  64.14,58.42 0 top
IC6  64.14,43.18 0 top
IC7  93.34,73.66 0 top
IC8  93.34,88.9 0 top
IC9  93.34,27.94 0 top
IC10  93.34,12.7 0 top
IC11  95.89,58.42 0 top
IC12  95.89,43.18 0 top
IC13  125.09,73.66 0 top
IC14  125.09,88.9 0 top
IC15  125.09,27.94 0 top
IC16  125.09,12.7 0 top
IC17  127.64,58.42 0 top
IC18  127.64,43.18 0 top
IC19  20.95,64.14 270 top
IC20  36.83,85.72 270 top
IC21  36.83,17.14 270 top
IC22  36.2,64.14 270 top
IC23  20.95,85.72 270 top
IC24  20.95,41.27 270 top
IC25  29.21,6.35 0 top
IC26  36.2,41.27 270 top
IC27  34.29,6.35 0 top
LOAD_WIDTH1  4.45,86.36 90 top
LOAD_WIDTH2  4.45,76.2 90 top
LOAD_WIDTH3  4.45,66.04 90 top
U$4  -185.42,182.88 0 top  (outside the outline)
U$5  -195.58,182.88 0 top  (outside the outline)
U$6  4.45,45.72 0 top

### Tracks (layer width: path | path; a pad name or v marks a point on that pad's centre or on a via)
+12V  (2 unrouted)
-INCA  (1 unrouted)
-INCDR  (1 unrouted)
-INCPC  (1 unrouted)
-LOAD_A  (4 unrouted)
-LOAD_DR  (4 unrouted)
-LOAD_PC  (4 unrouted)
-R_A  (4 unrouted)
-R_DR  (4 unrouted)
-R_PC  (4 unrouted)
-RESET  (2 unrouted)
-W_A  (3 unrouted)
-W_DR  (3 unrouted)
-W_PC  (3 unrouted)
F_ZERO  (1 unrouted)
GND
  pour Bottom (isolate 0.61, no thermals): 0,99.69 0,0 160.02,0 160.02,99.69
IBUS0  (6 unrouted)
IBUS1  (6 unrouted)
IBUS2  (6 unrouted)
IBUS3  (6 unrouted)
IBUS4  (6 unrouted)
IBUS5  (6 unrouted)
IBUS6  (6 unrouted)
IBUS7  (6 unrouted)
IBUS8  (6 unrouted)
IBUS9  (6 unrouted)
IBUS10  (6 unrouted)
IBUS11  (6 unrouted)
IBUS12  (6 unrouted)
IBUS13  (6 unrouted)
IBUS14  (6 unrouted)
IBUS15  (6 unrouted)
N$1  (1 unrouted)
N$3  (1 unrouted)
N$4  (1 unrouted)
N$5  (1 unrouted)
N$6  (1 unrouted)
N$7  (1 unrouted)
N$8  (1 unrouted)
N$9  (1 unrouted)
N$10  (1 unrouted)
N$11  (1 unrouted)
N$12  (1 unrouted)
N$13  (1 unrouted)
N$14  (1 unrouted)
N$15  (1 unrouted)
N$16  (1 unrouted)
N$17  (1 unrouted)
N$18  (1 unrouted)
N$19  (1 unrouted)
N$20  (1 unrouted)
N$24  (1 unrouted)
N$25  (1 unrouted)
N$26  (1 unrouted)
N$27  (1 unrouted)
N$28  (1 unrouted)
N$29  (1 unrouted)
N$30  (1 unrouted)
N$31  (1 unrouted)
N$32  (3 unrouted)
N$33  (2 unrouted)
N$34  (3 unrouted)
N$35  (2 unrouted)
N$36  (1 unrouted)
N$37  (3 unrouted)
N$38  (2 unrouted)
N$39  (1 unrouted)
N$40  (3 unrouted)
N$41  (2 unrouted)
N$42  (3 unrouted)
N$43  (1 unrouted)
N$44  (1 unrouted)
N$45  (1 unrouted)
N$46  (1 unrouted)
N$58  (1 unrouted)
N$66  (1 unrouted)
N$67  (1 unrouted)
N$68  (1 unrouted)
N$69  (1 unrouted)
N$70  (1 unrouted)
N$71  (1 unrouted)
N$72  (1 unrouted)
N$73  (1 unrouted)
N$74  (1 unrouted)
N$75  (1 unrouted)
N$76  (1 unrouted)
N$77  (1 unrouted)
N$78  (1 unrouted)
N$79  (1 unrouted)
N$80  (1 unrouted)
N$81  (1 unrouted)
N$82  (1 unrouted)
N$83  (1 unrouted)
N$84  (1 unrouted)
N$85  (1 unrouted)
N$86  (1 unrouted)
N$87  (1 unrouted)
N$88  (1 unrouted)
N$89  (1 unrouted)
N$90  (1 unrouted)
N$91  (1 unrouted)
N$92  (1 unrouted)
N$93  (1 unrouted)
N$94  (2 unrouted)
N$95  (1 unrouted)
N$96  (3 unrouted)
N$97  (2 unrouted)
N$98  (3 unrouted)
N$99  (2 unrouted)
N$100  (3 unrouted)
N$101  (2 unrouted)
N$102  (1 unrouted)
N$103  (3 unrouted)
N$104  (2 unrouted)
RESERVED_POWER  (2 unrouted)
RESET  (12 unrouted)
VCC
  pour Top (isolate 0.61, no thermals): 0,99.69 0,-0.64 160.02,-0.64 160.02,99.69